# Altium project Arduino_DevelopBoard.PrjPcb
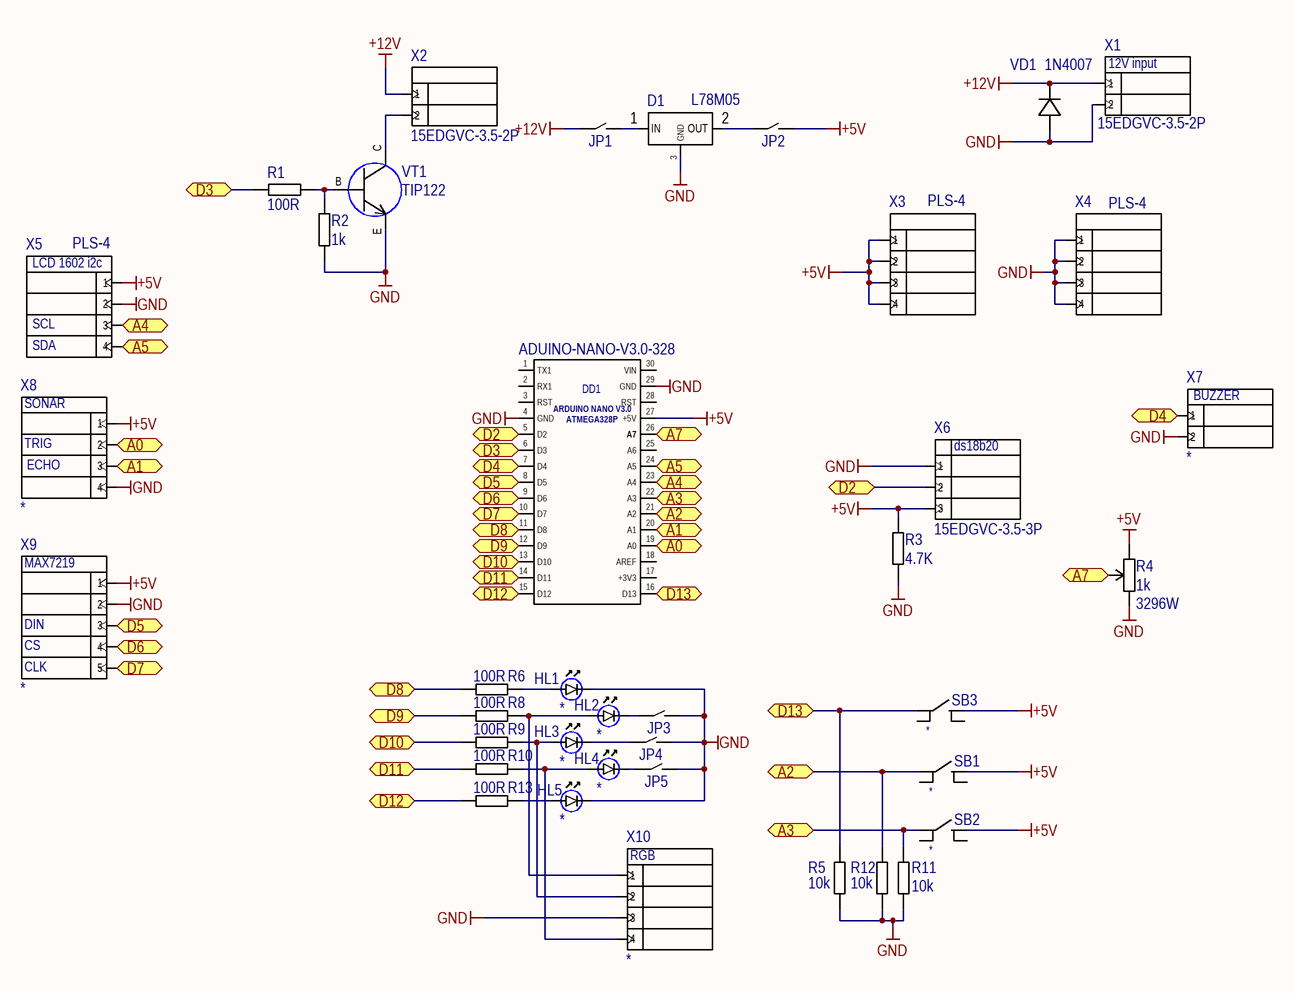
[diagram p0: ArduinoDevelopBoard-v2.SchDoc]
1 sheet, 39 parts. Net scope: flat (ports and power ports of the same name join across sheets).
Board files: ArduinoDevBoard-v2-fix-rules.PcbDoc, ArduinoDevBoard.PcbDoc, PCB1.PcbDoc

## Sheet ArduinoDevelopBoard-v2.SchDoc
size 420 x 297 mm; Address1: Address1; Address2: Address2; Address3: Address3; Address4: Address4; DocumentNumber: АБВГ.123456.001 Э3; SheetNumber: 1; Scale: 1:1; DocumentType: Схема электрическая принципиальная; FirstReferrence: АБВГ.123456.001

### Parts
D1  L78M05  [D-PAK]
DD1  ADUINO-NANO-V3.0-328  [ARDUINO_NANO_V3.0]
HL1  *  [Led Diode 5mm]
HL2  *  [Led Diode 5mm]
HL3  *  [Led Diode 5mm]
HL4  *  [Led Diode 5mm]
HL5  *  [Led Diode 5mm]
JP1  Jumper  [PLS-2]  (value not drawn)
JP2  Jumper  [PLS-2]  (value not drawn)
JP3  Jumper  [PLS-2]  (value not drawn)
JP4  Jumper  [PLS-2]  (value not drawn)
JP5  Jumper  [PLS-2]  (value not drawn)
R1  100R  [Resistor-0.25W]
R2  1k  [Resistor-0.25W]
R3  4.7K  [Resistor-0.25W]
R4  1k  [3296W_Resistor]
R5  10k  [Resistor-0.25W]
R6  100R  [Resistor-0.25W]
R8  100R  [Resistor-0.25W]
R9  100R  [Resistor-0.25W]
R10  100R  [Resistor-0.25W]
R11  10k  [Resistor-0.25W]
R12  10k  [Resistor-0.25W]
R13  100R  [Resistor-0.25W]
SB1  *  [KLS7-TS6601-5.0-180]
SB2  *  [KLS7-TS6601-5.0-180]
SB3  *  [KLS7-TS6601-5.0-180]
VD1  1N4007  [Diode (DO41)]
VT1  TIP122  [TO220]
X1  15EDGVC-3.5-2P  [15EDGVC-3.5-2P]
X2  15EDGVC-3.5-2P  [15EDGVC-3.5-2P]
X3  PLS-4  [PLS-4]
X4  PLS-4  [PLS-4]
X5  PLS-4  [PLS-4]
X6  15EDGVC-3.5-3P  [PLS-3]
X7  *  [PLS-2]
X8  *  [PLS-4]
X9  *  [PLS-5]
X10  *  [PLS-4]

### Ports
A0, A1, A2, A3, A4, A5, A7, D2, D3, D4, D5, D6, D7, D8, D9, D10, D11, D12, D13

### Nets
+5V: DD1.27(+5V) JP2.2 R3.2 R4.3 SB1.3 SB2.3 SB3.3 X3.1 X3.2 X3.3 X3.4 X5.1 X6.3 X8.1 X9.1
+12V: JP1.1 VD1.2 X1.1 X2.1
GND: D1.3(GND) DD1.4(GND) DD1.29(GND) HL1.2 HL5.2 JP3.2 JP4.2 JP5.2 R2.2 R3.1 R4.1 R5.1 R11.1 R12.1 VD1.1 VT1.E X1.2 X4.1 X4.2 X4.3 X4.4 X5.2 X6.1 X7.2 X8.4 X9.2 X10.3
NetD1_1: D1.1(IN) JP1.2
NetD1_2: D1.2(OUT) JP2.1
NetDD1_5: DD1.5(D2) X6.2 ; port D2
NetDD1_6: DD1.6(D3) R1.2 ; port D3
NetDD1_7: DD1.7(D4) X7.1 ; port D4
NetDD1_8: DD1.8(D5) X9.3 ; port D5
NetDD1_9: DD1.9(D6) X9.4 ; port D6
NetDD1_10: DD1.10(D7) X9.5 ; port D7
NetDD1_11: DD1.11(D8) R6.1 ; port D8
NetDD1_12: DD1.12(D9) R8.1 ; port D9
NetDD1_13: DD1.13(D10) R9.1 ; port D10
NetDD1_14: DD1.14(D11) R10.1 ; port D11
NetDD1_15: DD1.15(D12) R13.1 ; port D12
NetDD1_16: DD1.16(D13) R5.2 SB3.1 ; port D13
NetDD1_19: DD1.19(A0) X8.2 ; port A0
NetDD1_20: DD1.20(A1) X8.3 ; port A1
NetDD1_21: DD1.21(A2) R12.2 SB1.1 ; port A2
NetDD1_22: DD1.22(A3) R11.2 SB2.1 ; port A3
NetDD1_23: DD1.23(A4) X5.3 ; port A4
NetDD1_24: DD1.24(A5) X5.4 ; port A5
NetDD1_26: DD1.26(A7) R4.2 ; port A7
NetHL1_1: HL1.1 R6.2
NetHL2_1: HL2.1 R8.2 X10.1
NetHL2_2: HL2.2 JP3.1
NetHL3_1: HL3.1 R9.2 X10.2
NetHL3_2: HL3.2 JP4.1
NetHL4_1: HL4.1 R10.2 X10.4
NetHL4_2: HL4.2 JP5.1
NetHL5_1: HL5.1 R13.2
NetR1_1: R1.1 R2.1 VT1.B
NetVT1_C: VT1.C X2.2

Not connected (* = marked no-connect by the designer): DD1 1(TX1) 2(RX1) 3(RST) 17(+3V3) 18(AREF) 25(A6) 28(RST) 30(VIN); SB1 2 4; SB2 2 4; SB3 2 4

### Notes on the sheet
- (near X1) 12V input
- (near X5) LCD 1602 i2c
- SDA
- SCL
- SONAR
- (near X7) BUZZER
- (near X8) TRIG
- (near X8) ECHO
- (near X6) ds18b20
- DIN
- (near X9) MAX7219
- CS
- CLK
- (near X10) RGB
- Перв. примен.
- Справ. №
- Подп. и дата
- Инв. № дубл.
- Взам. инв. №
- Разраб.
- Изм.
- Лист
- № докум.
- Подп.
- Дата
- Лит.
- Масса
- Масштаб
- Пров.
- Т.контр.
- Листов
- Инв. № подл.
- Утв.
- Н.контр.
- 2.106-A3
- Копировал
- Формат А3
- (in symbol ARDUINO-NANO-V3.0-328) ARDUINO NANO V3.0; ATMEGA328P

### Library data of the parts
DD1 = ARDUINO-NANO-V3.0-328
HL1-HL5 = Led-5mm: Color: *
R1-R3 R5 R11 R12 = Resistor 0.25W: =Power; Power: *
  R1: Value: 100R
  R2: Value: 1k
  R3: Value: 4.7K
  R5 R11 R12: Value: 10k
R4 = 3296W: 3296; Value: 1k; Case: 3296W
R6 R8-R10 R13 = Resistor 0.25W: =Power; Value: 240R; Power: *
SB1-SB3 = KLS7-TS6601-5.0-180: Model: *
VD1 = 1N4007: 1A, 1000V
VT1 = TIP122: PNP Transistor; pin to pad: B>1 C>2 E>3
X1 X2 X7 = Connector-2Pin
  X1 X2: Case: 15EDGVC-3.5-2P
  X7: Case: *
X3-X5 X8 X10 = Connector-4Pin
  X3-X5: Case: PLS-4
  X8 X10: Case: *
X6 = Connector-3Pin: Case: 15EDGVC-3.5-3P
X9 = Connector-5Pin: Case: *